# EAGLE design Qwiic_SAO (EAGLE 9.1.2)
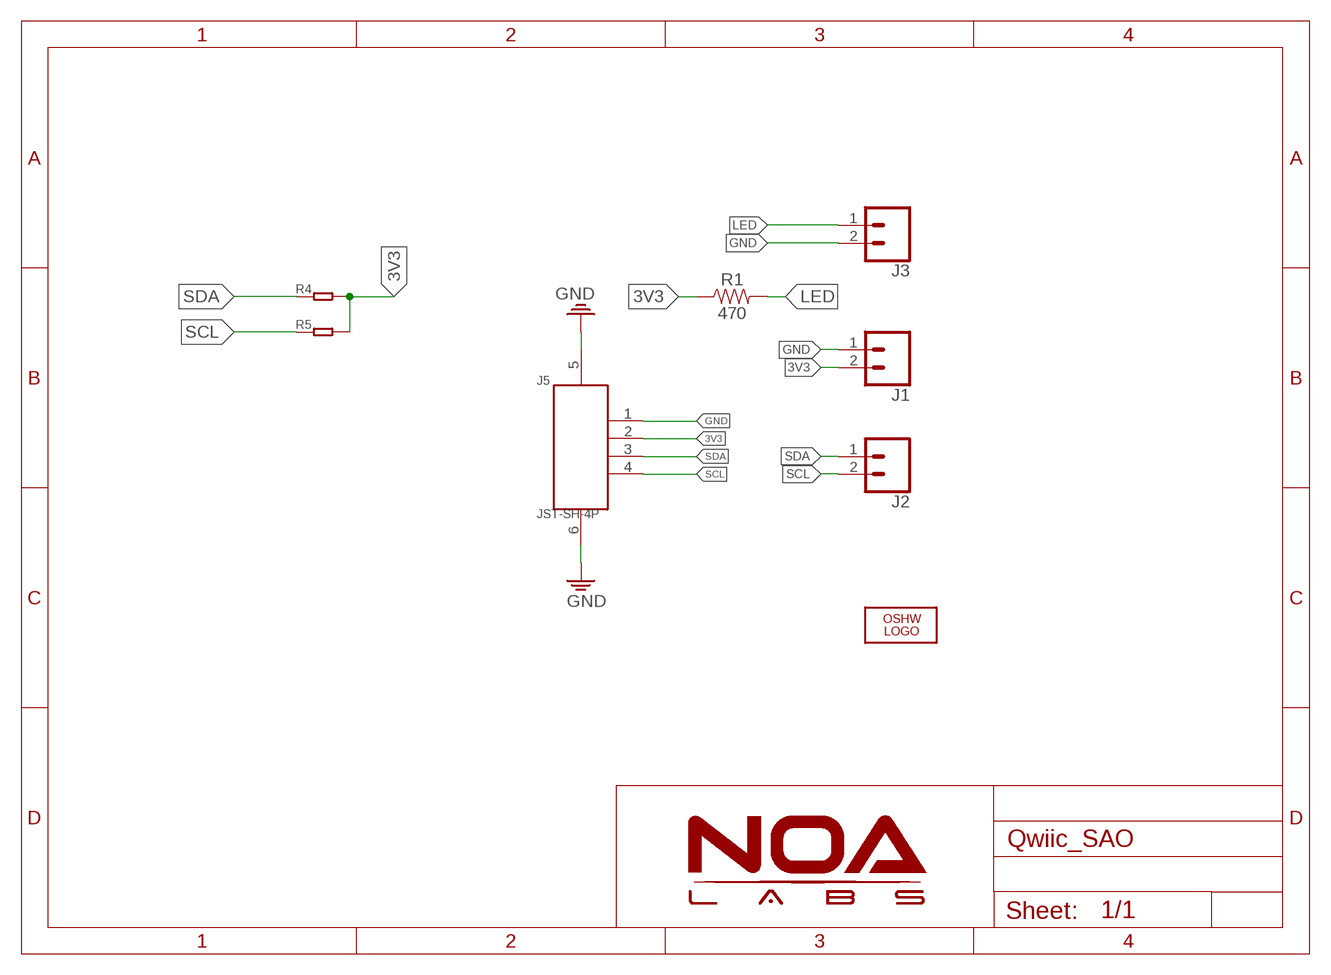
[diagram p0: schematic, sheet 1]

## Parts
J1  CONN_02  [1X02]
J2  CONN_02  [1X02]
J3  CONN_02  [1X02]
J5  JST-SH-4P  [SM04B-SRSS-TB]
LOGO1  LOGO-OSHW-6MILX0070-NT  [OSHW_6X70_NOTEXT]
R1  470  470OHM-0603-1/10W-1%  [0603]
R4  R-0603  [R0603]
R5  R-0603  [R0603]

## Nets
3V3: J1.2 J5.2 R1.1 R4.2 R5.2
GND: J1.1 J3.2 J5.1 J5.5 J5.6
LED: J3.1 R1.2
SCL: J2.2 J5.4 R5.1
SDA: J2.1 J5.3 R4.1

## Library data of the parts
J1-J3 = SparkFun-Connectors:CONN_02: Multi connection point. Often used as Generic Header-pin footprint for 0.1 inch spaced/style header connections On any of the 0.1 inch spaced packages, you can populate with these: Break Away Headers - Straight <https://www.sparkfun.com/products/116> (PRT-00116) Break Away Male Headers - Right Angle <https://www.sparkfun.com/products/553> (PRT-00553) Female Headers <https://www.sparkfun.com/products/115> (PRT-00115) Break Away Headers - Machine Pin <https://www.sparkfun.com/products/117> (PRT-00117) Break Away Female Headers - Swiss Machine Pin <https://www.sparkfun.com/products/743> (PRT-00743) For SCREWTERMINALS and SPRING TERMINALS visit here: Screw Terimnals on SparkFun.com <https://www.sparkfun.com/search/results?term=Screw+Terminals> (5mm/3.5mm/2.54mm spacing) This device is also useful as a general connection point to wire up your design to another part of your project. Our various solder wires solder well into these plated through hole pads. Hook-Up Wire - Assortment (Stranded, 22 AWG) <https://www.sparkfun.com/products/11375> (PRT-11375) Hook-Up Wire - Assortment (Solid Core, 22 AWG) <https://www.sparkfun.com/products/11367> (PRT-11367) View the entire wire category on our website here <https://www.sparkfun.com/categories/141> Special notes: Molex polarized connector foot print use with: PRT-08233 with associated crimp pins and housings. 2.54_SCREWTERM for use with PRT-10571. 3.5mm Screw Terminal footprints for PRT-08084 5mm Screw Terminal footprints for use with PRT-08432
J5 = Connector:JST-SH-4P
LOGO1 = Logo:LOGO-OSHW-6MIL
R1 = SparkFun-Resistors:470OHM: 470Ω resistor A resistor is a passive two-terminal electrical component that implements electrical resistance as a circuit element. Resistors act to reduce current flow, and, at the same time, act to lower voltage levels within circuits. - Wikipedia; PROD_ID: RES-07869
R4 R5 = RCL:R

## Board
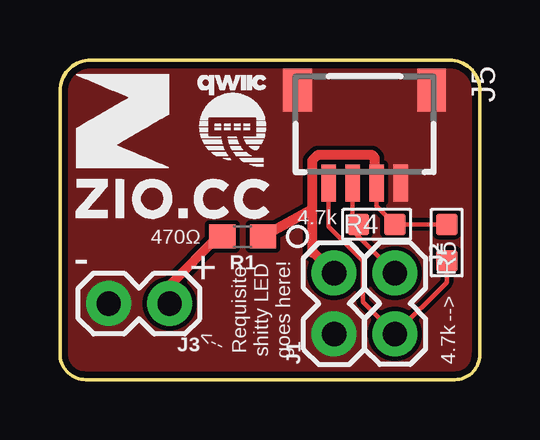
[diagram p1: board, top side]
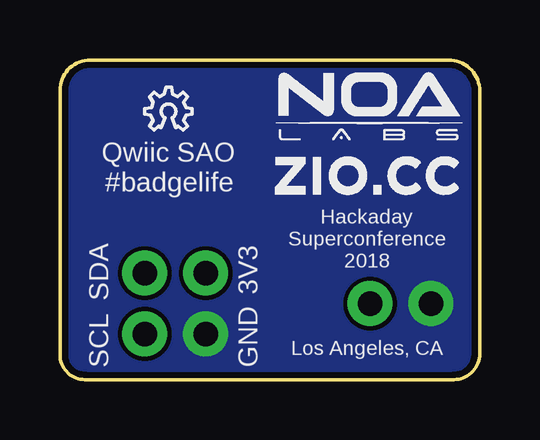
[diagram p2: board, bottom side, seen from below]

Size 17.51 x 13.34 mm. Coordinates in mm from the lower left corner, seen from the top.
Outline: 17.51,12.07 17.51,1.04 arc-90 16.47,0 1.07,0 arc-90 0,1.07 0,12.03 arc-90 1.3,13.34 16.24,13.34 arc-90 17.51,12.07
Copper layers (1*16): Top 0.035mm / dielectric 1.5mm / Bottom 0.035mm
Design rules "NOA Eagle Rule *": minimum track width 7mil, minimum drill 12mil, track to track 7mil, track to pad 7mil, pad to pad 7mil, via to via 7mil, smd to smd 0mil, copper to edge 10mil, drill to drill 10mil, minimum pad ring 10mil, minimum via ring 6mil, stop-mask expansion 2mil, vias tented up to drill 25mil, thermal gap 10mil

### Footprints (pad centres in the part's own frame; a part is rotated, then mirrored left to right if it is on the bottom)
1X02 = drill 1.016 pad 1.88: 1 0,0; 2 2.54,0
SM04B-SRSS-TB = smd 0.6 x 1.55: 1 -1.5,2.975; 2 -0.5,2.975; 3 0.5,2.975; 4 1.5,2.975 | smd 1.2 x 1.8: 5 -2.8,-0.9; 6 2.8,-0.9
0603 = smd 1.1 x 1: 1 -0.85,0; 2 0.85,0
R0603 = smd 0.889 x 0.889: 1 -0.762,0; 2 0.762,0

### Placement (x,y rotation side)
J1  11.43,1.91 90 top
J2  13.97,4.45 270 top
J3  4.57,3.17 180 top
J5  12.7,11.18 180 top
LOGO1  13.97,10.41 0 bottom
R1  7.62,5.97 180 top
R4  13.21,6.48 0 top
R5  16.13,5.71 90 top
U$1  [6MM]  0.64,6.73 0 top
U$2  [1.5MM]  -5.46,9.78 0 bottom  (outside the outline)
U$3  [QWIIC-LOGO-SMALL]  7.11,10.79 0 top

### Tracks (layer width: path | path; a pad name or v marks a point on that pad's centre or on a via)
3V3
  Top 0.178: J5.2 13.2,7.25 R4.2 R5.2
  Top 0.406: J1.2 10.58,5.29 10.52,5.29 10.52,5.66 | R1.1 10.52,7.1 10.52,5.66 | J5.2 13.13,8.2 13.13,9.26 13.04,9.36 10.74,9.36 10.52,9.13 10.52,5.68 10.52,5.66
GND
  pour Top (no thermals): 0,1.07 0,12.03 arc-90 1.3,13.34 16.23,13.34 arc-90 17.53,12.03 17.53,1.07 arc-90 16.45,0 1.07,0 arc-90
  pour Bottom (no thermals): 17.54,12.01 17.51,1.05 arc-90 16.46,0 1.07,0 arc-90 0,1.07 0,12.03 arc-90 1.3,13.34 16.22,13.34 arc-90
LED
  Top 0.406: R1.2 6.6,5.97 4.57,3.94 J3.1
SCL
  Top 0.178: J5.4 11.2,6.38 12.64,4.95 12.64,3.24 J2.2 16.13,4.06 R5.1
SDA
  Top 0.178: J2.1 12.2,6.21 | 12.2,6.21 J5.3 | R4.1 12.2,6.23 12.2,6.21

### Text on the board
tPlace: 470Ω | 4.7k | - | + | Requisite / shitty LED / goes here! | <-- | 4.7k | -->
bPlace: Qwiic SAO | #badgelife | Hackaday / Superconference / 2018 / / / / Los Angeles, CA | 3V3 | SDA | GND | SCL